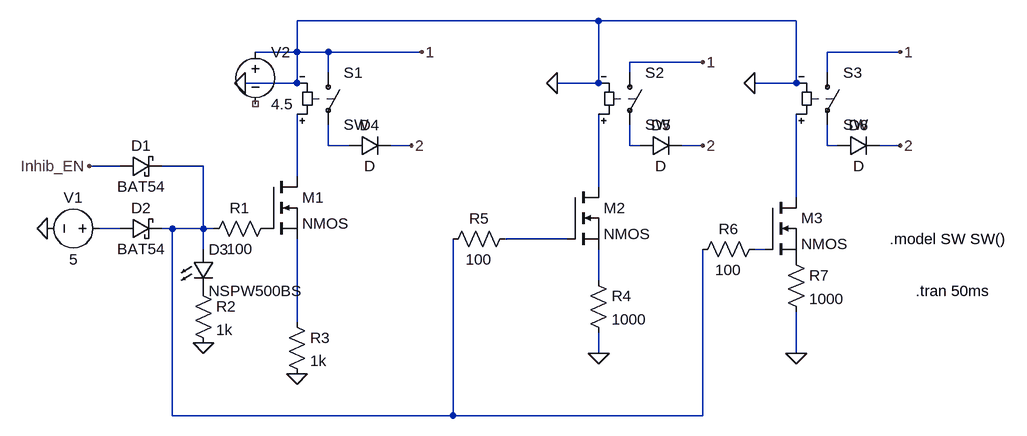
[diagram p0: schematic Enable_RBF_logic.asc]
Enable_RBF_logic.asc, the LTspice schematic file:
Version 4
SHEET 1 1536 680
WIRE 896 -240 432 -240
WIRE 1200 -240 896 -240
WIRE 432 -192 432 -240
WIRE 432 -192 368 -192
WIRE 480 -192 432 -192
WIRE 624 -192 480 -192
WIRE 1360 -192 1248 -192
WIRE 1056 -176 944 -176
WIRE 480 -160 480 -192
WIRE 944 -160 944 -176
WIRE 1248 -160 1248 -192
WIRE 432 -144 432 -192
WIRE 432 -144 352 -144
WIRE 896 -144 896 -240
WIRE 896 -144 832 -144
WIRE 1200 -144 1200 -240
WIRE 1200 -144 1136 -144
WIRE 480 -48 480 -80
WIRE 512 -48 480 -48
WIRE 608 -48 576 -48
WIRE 944 -48 944 -80
WIRE 960 -48 944 -48
WIRE 1056 -48 1024 -48
WIRE 1248 -48 1248 -80
WIRE 1264 -48 1248 -48
WIRE 1360 -48 1328 -48
WIRE 160 -16 112 -16
WIRE 288 -16 224 -16
WIRE 432 0 432 -96
WIRE 896 16 896 -96
WIRE 1200 32 1200 -96
WIRE 160 80 128 80
WIRE 240 80 224 80
WIRE 288 80 288 -16
WIRE 288 80 240 80
WIRE 304 80 288 80
WIRE 848 96 752 96
WIRE 288 112 288 80
WIRE 1152 112 1136 112
WIRE 896 160 896 112
WIRE 432 224 432 96
WIRE 896 272 896 240
WIRE 1200 272 1200 208
WIRE 240 368 240 80
WIRE 672 368 672 96
WIRE 672 368 240 368
WIRE 1056 368 1056 112
WIRE 1056 368 672 368
FLAG 48 80 0
FLAG 112 -16 Inhib_EN
FLAG 288 256 0
FLAG 432 304 0
FLAG 352 -144 0
FLAG 832 -144 0
FLAG 896 272 0
FLAG 1136 -144 0
FLAG 1200 272 0
FLAG 608 -48 2
FLAG 1056 -48 2
FLAG 1360 -48 2
FLAG 1360 -192 1
FLAG 1056 -176 1
FLAG 624 -192 1
SYMBOL schottky 160 0 R270
WINDOW 0 32 32 VTop 2
WINDOW 3 0 32 VBottom 2
SYMATTR InstName D1
SYMATTR Value BAT54
SYMATTR Description Diode
SYMATTR Type diode
SYMBOL schottky 160 96 R270
WINDOW 0 32 32 VTop 2
WINDOW 3 0 32 VBottom 2
SYMATTR InstName D2
SYMATTR Value BAT54
SYMATTR Description Diode
SYMATTR Type diode
SYMBOL voltage 144 80 R90
WINDOW 0 -32 56 VBottom 2
WINDOW 3 32 56 VTop 2
WINDOW 123 0 0 Left 0
WINDOW 39 0 0 Left 0
SYMATTR InstName V1
SYMATTR Value 5
SYMBOL res 288 96 R270
WINDOW 0 32 56 VTop 2
WINDOW 3 0 56 VBottom 2
SYMATTR InstName R1
SYMATTR Value 100
SYMBOL LED 272 112 R0
SYMATTR InstName D3
SYMATTR Value NSPW500BS
SYMATTR Description Diode
SYMATTR Type diode
SYMBOL res 272 160 R0
SYMATTR InstName R2
SYMATTR Value 1k
SYMBOL nmos 384 0 R0
SYMATTR InstName M1
SYMBOL res 416 208 R0
SYMATTR InstName R3
SYMATTR Value 1k
SYMBOL sw 480 -176 R0
SYMATTR InstName S1
SYMBOL sw 944 -176 R0
SYMATTR InstName S2
SYMBOL nmos 848 16 R0
SYMATTR InstName M2
SYMBOL res 880 144 R0
SYMATTR InstName R4
SYMATTR Value 1000
SYMBOL res 768 80 R90
WINDOW 0 0 56 VBottom 2
WINDOW 3 32 56 VTop 2
SYMATTR InstName R5
SYMATTR Value 100
SYMBOL sw 1248 -176 R0
SYMATTR InstName S3
SYMBOL nmos 1152 32 R0
SYMATTR InstName M3
SYMBOL res 1152 96 R90
WINDOW 0 0 56 VBottom 2
WINDOW 3 32 56 VTop 2
SYMATTR InstName R6
SYMATTR Value 100
SYMBOL res 1184 112 R0
SYMATTR InstName R7
SYMATTR Value 1000
SYMBOL diode 512 -32 R270
WINDOW 0 32 32 VTop 2
WINDOW 3 0 32 VBottom 2
SYMATTR InstName D4
SYMBOL diode 960 -32 R270
WINDOW 0 32 32 VTop 2
WINDOW 3 0 32 VBottom 2
SYMATTR InstName D5
SYMBOL diode 1264 -32 R270
WINDOW 0 32 32 VTop 2
WINDOW 3 0 32 VBottom 2
SYMATTR InstName D6
SYMBOL voltage 368 -208 R0
WINDOW 123 0 0 Left 0
WINDOW 39 0 0 Left 0
SYMATTR InstName V2
SYMATTR Value 4.5
TEXT 1344 96 Left 2 !.model SW SW()
TEXT 1384 176 Left 2 !.tran 50ms

The netlist it stands for:
* Enable_RBF_logic.asc
D1 Inhib_EN N004 BAT54
D2 N008 N004 BAT54
V1 N008 0 5
R1 N004 P001 100
D3 N004 P002 NSPW500BS
R2 P002 0 1k
M1 N005 P001 N012 N012 NMOS
R3 N012 0 1k
S1 0 N001 N005 0 SW
S2 0 N002 N006 0 SW
M2 N006 N009 N011 N011 NMOS
R4 N011 0 1000
R5 N009 N004 100
S3 0 N003 N007 0 SW
M3 N007 N010 P003 P003 NMOS
R6 N010 N004 100
R7 P003 0 1000
D4 N001 2 D
D5 N002 2 D
D6 N003 2 D
V2 0 NC_01 4.5
.model D D
.lib standard.dio
.model NMOS NMOS
.model PMOS PMOS
.lib standard.mos
.model SW SW()
.tran 50ms
.backanno
.end